# Altium schematic sheet RADG-Master-S00-V00.SchDoc: RADG Master (Top Level)
size A3; DrawnBy: Jonn Dillon; DocumentNumber: 1; SheetNumber: 1; SheetTotal: 6; Version: 00; Project: QUTMS RADIO GPS; PageSetup: Record=PageOptions|CenterHorizontal=True|CenterVertical=True|PrintScale=0.97|XCorrection=1.00|YCorrection=1.00|PrintKind=0|BorderSize=5000000|LeftOffset=0|BottomOffset=0|Orientation=2|PaperLength=1000|PaperWidth=1000|Scale=100|PaperSource=7|PrintQuality=-4|MediaType=1|DitherType=10|PaperKind=A4|PrintScaleMode=1
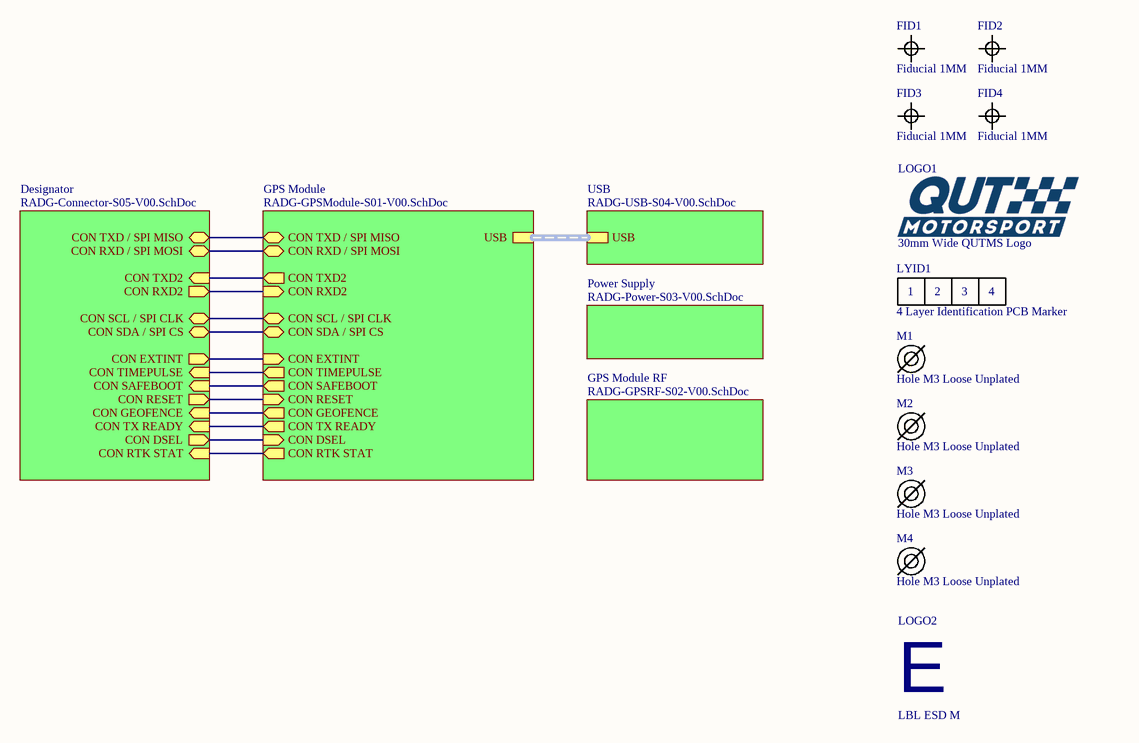
[diagram p0: RADG-Master-S00-V00.SchDoc]

## Parts
FID1  Fiducial 1MM  [FIDUCIAL 1MM]  (no BOM)
FID2  Fiducial 1MM  [FIDUCIAL 1MM]  (no BOM)
FID3  Fiducial 1MM  [FIDUCIAL 1MM]  (no BOM)
FID4  Fiducial 1MM  [FIDUCIAL 1MM]  (no BOM)
LOGO1  30mm Wide QUTMS Logo  [QUTMS LOGO 30MM]  (no BOM)
LOGO2  LBL ESD M  [LBL ESD MEDIUM]  (no BOM)
LYID1  4 Layer Identification PCB Marker  [LAYER IDENT 4]  (no BOM)
M1  Hole M3 Loose Unplated  [M3.5 UNPLATED]  (no BOM)
M2  Hole M3 Loose Unplated  [M3.5 UNPLATED]  (no BOM)
M3  Hole M3 Loose Unplated  [M3.5 UNPLATED]  (no BOM)
M4  Hole M3 Loose Unplated  [M3.5 UNPLATED]  (no BOM)

## Sub-sheets
Designator = RADG-Connector-S05-V00.SchDoc: CON TXD / SPI MISO (bidir), CON RXD / SPI MOSI (bidir), CON TXD2 (in), CON RXD2 (out), CON SCL / SPI CLK (bidir), CON SDA / SPI CS (bidir), CON EXTINT (out), CON TIMEPULSE (in), CON SAFEBOOT (in), CON RESET (out), CON GEOFENCE (in), CON TX READY (in), CON DSEL (out), CON RTK STAT (in)
GPS Module = RADG-GPSModule-S01-V00.SchDoc: USB (harness USB), CON TX READY (out), CON DSEL (in), CON RTK STAT (out), CON SCL / SPI CLK (bidir), CON RXD2 (in), CON RESET (in), CON GEOFENCE (out), CON TXD2 (out), CON EXTINT (in), CON TIMEPULSE (out), CON SAFEBOOT (out), CON SDA / SPI CS (bidir), CON RXD / SPI MOSI (bidir), CON TXD / SPI MISO (bidir)
GPS Module RF = RADG-GPSRF-S02-V00.SchDoc: no entries
Power Supply = RADG-Power-S03-V00.SchDoc: no entries
USB = RADG-USB-S04-V00.SchDoc: USB

## Nets
(unnamed): sheet GPS Module/CON TX READY, sheet Designator/CON TX READY
(unnamed): sheet GPS Module/CON DSEL, sheet Designator/CON DSEL
(unnamed): sheet GPS Module/CON RTK STAT, sheet Designator/CON RTK STAT
(unnamed): sheet GPS Module/CON SCL / SPI CLK, sheet Designator/CON SCL / SPI CLK
(unnamed): sheet GPS Module/CON RXD2, sheet Designator/CON RXD2
(unnamed): sheet GPS Module/CON RESET, sheet Designator/CON RESET
(unnamed): sheet GPS Module/CON GEOFENCE, sheet Designator/CON GEOFENCE
(unnamed): sheet GPS Module/CON TXD2, sheet Designator/CON TXD2
(unnamed): sheet GPS Module/CON EXTINT, sheet Designator/CON EXTINT
(unnamed): sheet GPS Module/CON TIMEPULSE, sheet Designator/CON TIMEPULSE
(unnamed): sheet GPS Module/CON SAFEBOOT, sheet Designator/CON SAFEBOOT
(unnamed): sheet GPS Module/CON SDA / SPI CS, sheet Designator/CON SDA / SPI CS
(unnamed): sheet GPS Module/CON RXD / SPI MOSI, sheet Designator/CON RXD / SPI MOSI
(unnamed): sheet GPS Module/CON TXD / SPI MISO, sheet Designator/CON TXD / SPI MISO

## Buses and harness runs
harness sheet GPS Module/USB = sheet USB/USB

## Notes on the sheet
- Revision History:
- Sheet Title:
- Rev
- Date
- Description
- Project:
- Size:
- Drawn By:
- A3
- Number:
- Revision:
- Sheet
- Version:
- of
- QUT Motorsport
- O-120, Gardens Point
- 2 George Street
- Brisbane, QLD 4000
- Australia
- Print Date:
- Print Time:
- File Name:
- (in symbol Layer Identification 4) 1; 2; 3; 4
- (in symbol LBL ESD M) E

## Library data of the parts
LOGO1 = QUTMS Logo 30mm
LYID1 = Layer Identification 4
M1-M4 = Hole M3 Loose Unplated: M3.5 Hole, No Plating